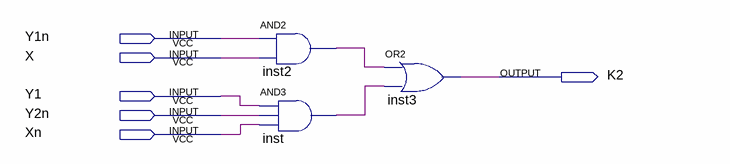
[diagram p0: schematic sheet]
// Quartus schematic K2.bdf as structural Verilog: 3 symbols, 6 pins
module K2 (
  input  Y1n,
  input  X,
  input  Y1,
  input  Y2n,
  input  Xn,
  output K2
);

  wire inst2_out, inst_out;

  and inst2 (inst2_out, Y1n, X);
  and inst (inst_out, Y1, Y2n, Xn);
  or inst3 (K2, inst2_out, inst_out);
endmodule
